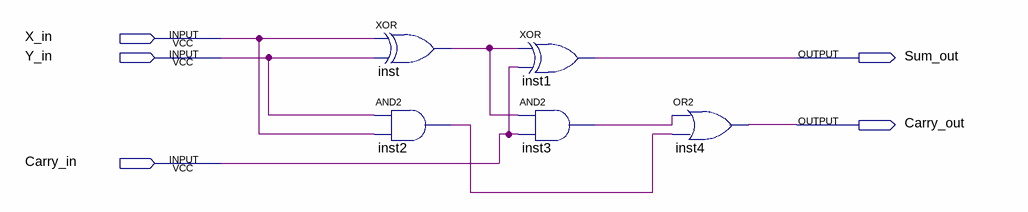
[diagram p0: schematic sheet]
// Quartus schematic fulladder1bit.bdf as structural Verilog: 5 symbols, 5 pins
module fulladder1bit (
  input  X_in,
  input  Y_in,
  input  Carry_in,
  output Sum_out,
  output Carry_out
);

  wire inst2_out, inst3_out, inst_out;

  xor inst (inst_out, X_in, Y_in);
  and inst2 (inst2_out, Y_in, X_in);
  xor inst1 (Sum_out, inst_out, Carry_in);
  and inst3 (inst3_out, inst_out, Carry_in);
  or inst4 (Carry_out, inst3_out, inst2_out);
endmodule
